# Altium schematic sheet Backup.SchDoc
size A2; SheetNumber: 1; SheetTotal: 1
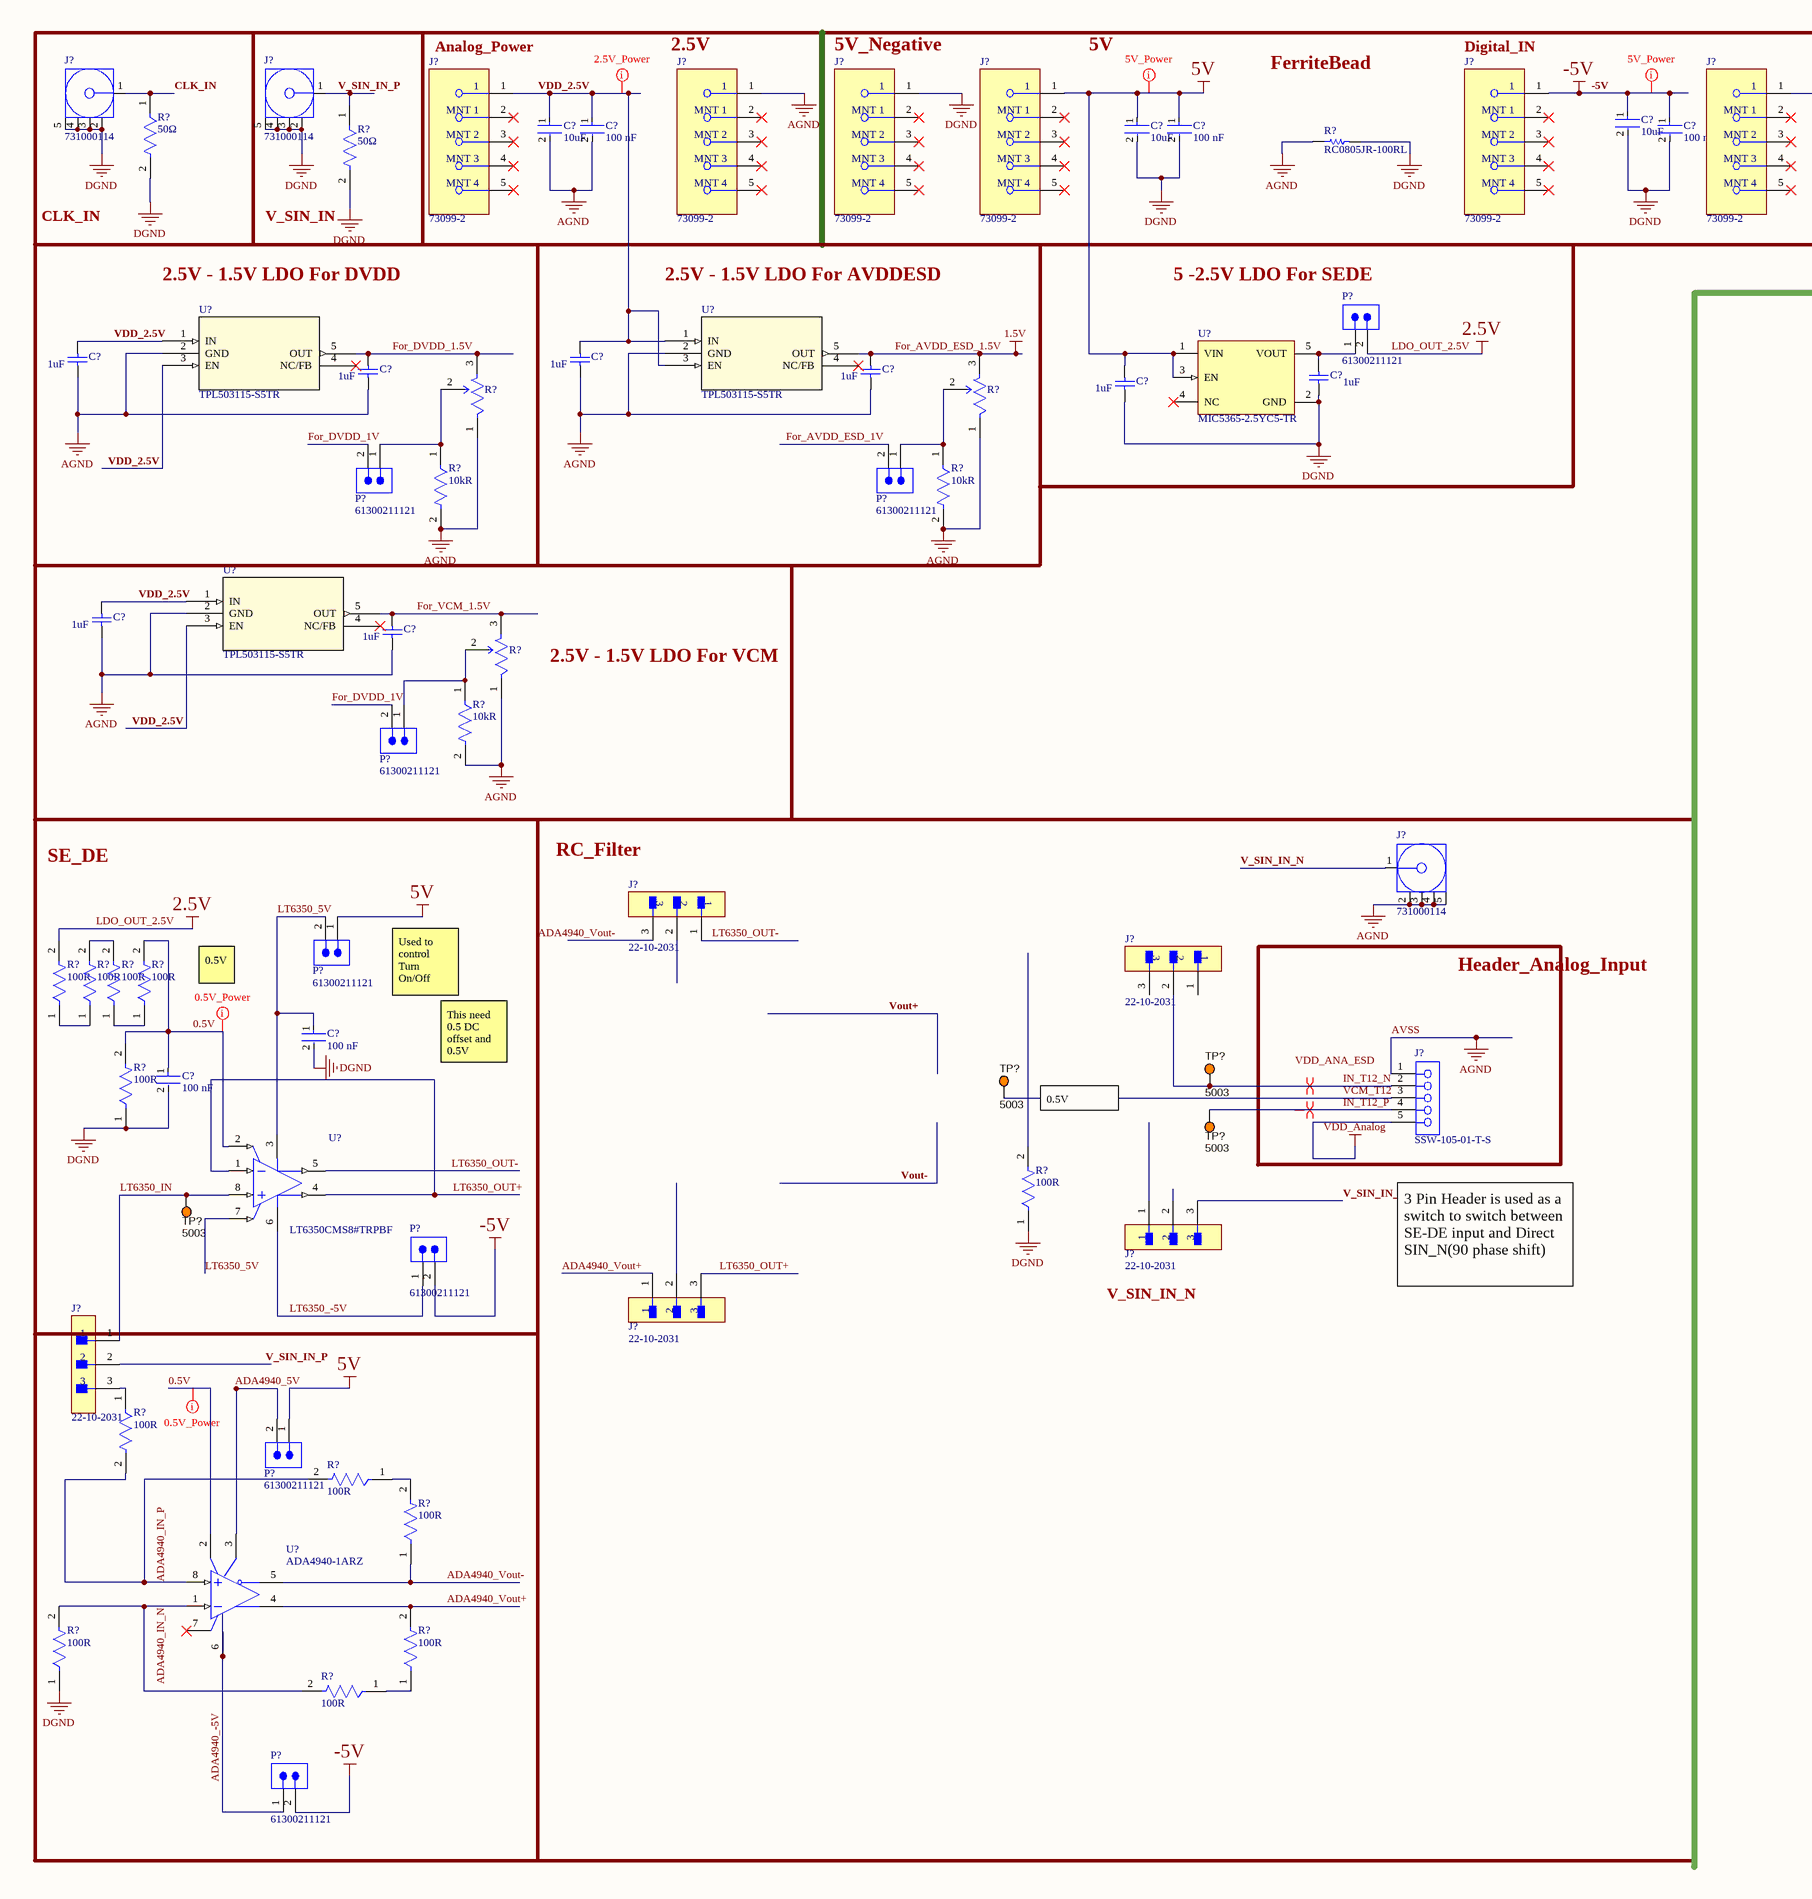
[diagram p0: Backup.SchDoc, left]
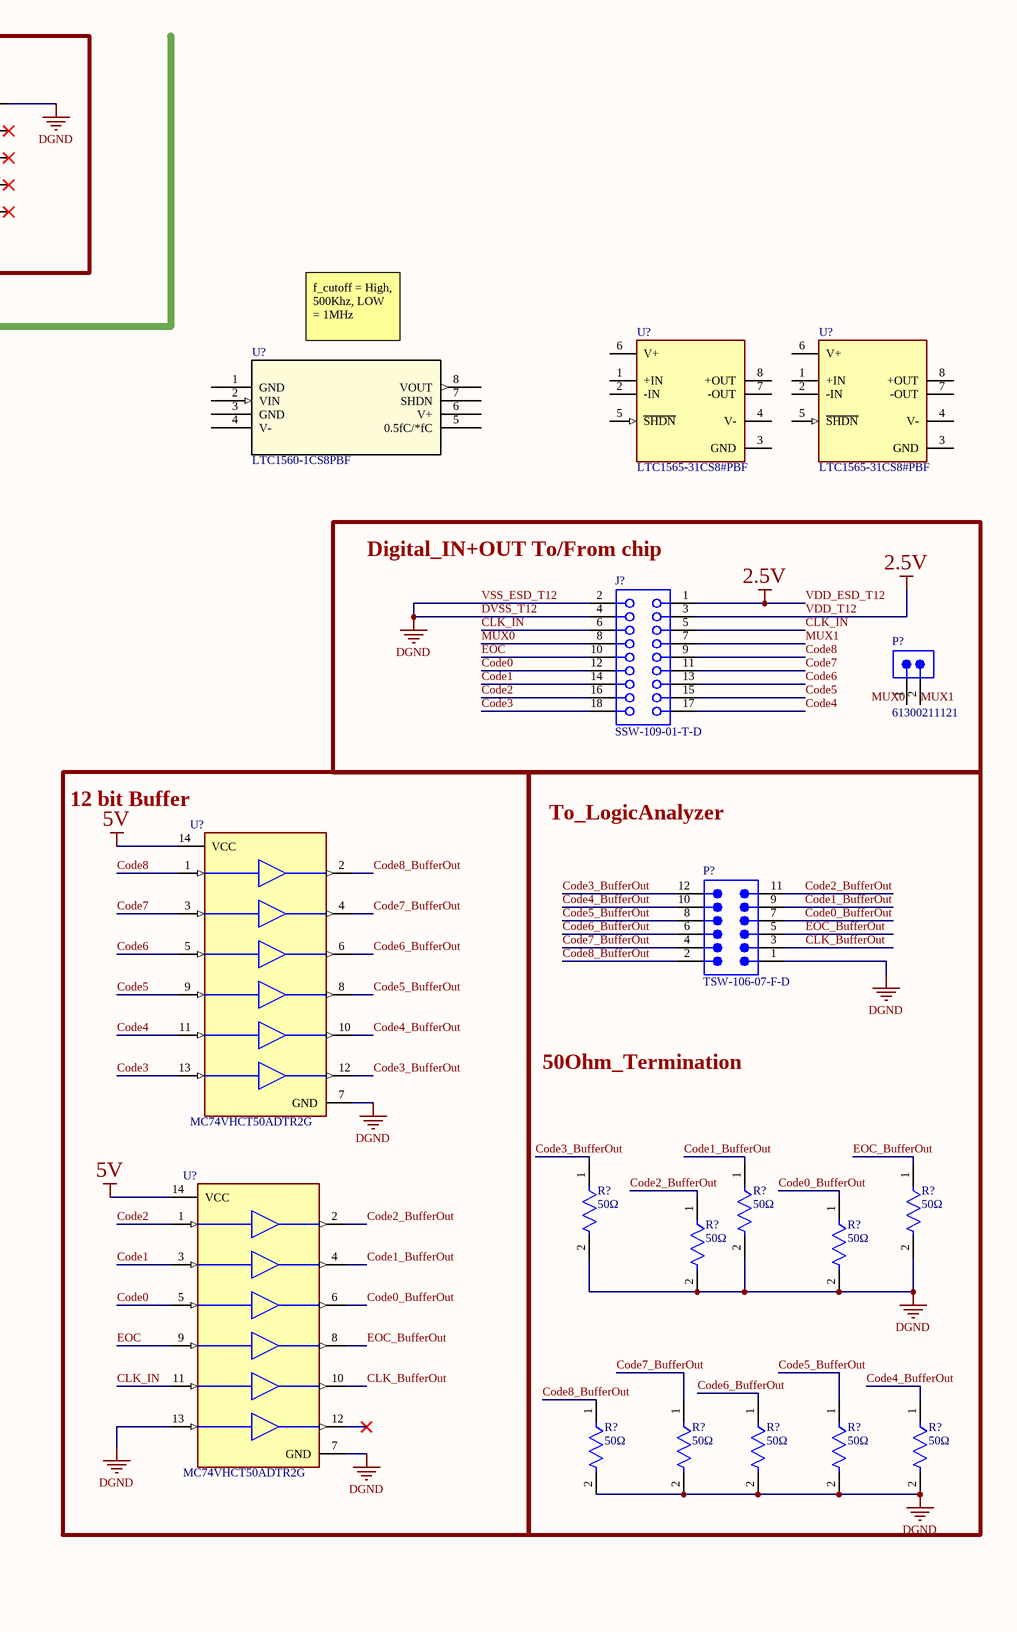
[diagram p1: Backup.SchDoc, right]

## Parts
(Parts that share a designator on the sheet are numbered #1, #2 ... from top to bottom, then left to right.)
C?#1  Capacitance: 10uF  [FP-0805-L_2_01_0_2-W_1_25-MFG]  (hidden comment: 0805ZD106MAT2A)
C?#2  Capacitance: 10uF  [FP-0805-L_2_01_0_2-W_1_25-MFG]  (hidden comment: 0805ZD106MAT2A)
C?#3  Capacitance: 100 nF  [FP-CC0805-0_85-MFG]  (hidden comment: CC0805KRX7R8BB104)
C?#4  Capacitance: 10uF  [FP-0805-L_2_01_0_2-W_1_25-MFG]  (hidden comment: 0805ZD106MAT2A)
C?#5  Capacitance: 100 nF  [FP-CC0805-0_85-MFG]  (hidden comment: CC0805KRX7R8BB104)
C?#6  Capacitance: 100 nF  [FP-CC0805-0_85-MFG]  (hidden comment: CC0805KRX7R8BB104)
C?#7  value 1uF  [CAPC2013X140X50LL20T25]  (hidden comment: 0805ZC105KAZ2A)
C?#8  value 1uF  [CAPC2013X140X50LL20T25]  (hidden comment: 0805ZC105KAZ2A)
C?#9  value 1uF  [CAPC2013X140X50LL20T25]  (hidden comment: 0805ZC105KAZ2A)
C?#10  value 1uF  [CAPC2013X140X50LL20T25]  (hidden comment: 0805ZC105KAZ2A)
C?#11  value 1uF  [CAPC2013X140X50LL20T25]  (hidden comment: 0805ZC105KAZ2A)
C?#12  value 1uF  [CAPC2013X140X50LL20T25]  (hidden comment: 0805ZC105KAZ2A)
C?#13  value 1uF  [CAPC2013X140X50LL20T25]  (hidden comment: 0805ZC105KAZ2A)
C?#14  value 1uF  [CAPC2013X140X50LL20T25]  (hidden comment: 0805ZC105KAZ2A)
C?#15  Capacitance: 100 nF  [FP-CC0805-0_85-MFG]  (hidden comment: CC0805KRX7R8BB104)
C?#16  Capacitance: 100 nF  [FP-CC0805-0_85-MFG]  (hidden comment: CC0805KRX7R8BB104)
J?#1  731000114  [MOLX-731000114_V]
J?#2  731000114  [MOLX-731000114_V]
J?#3  73099-2  [FP-73099-2-MFG]
J?#4  73099-2  [FP-73099-2-MFG]
J?#5  73099-2  [FP-73099-2-MFG]
J?#6  73099-2  [FP-73099-2-MFG]
J?#7  73099-2  [FP-73099-2-MFG]
J?#8  73099-2  [FP-73099-2-MFG]
J?#9  SSW-109-01-T-D  [SMTC-SSW-109-01-X-D]
J?#10  731000114  [MOLX-731000114_V]
J?#11  22-10-2031  [FP-22-10-2031-MFG]
J?#12  22-10-2031  [FP-22-10-2031-MFG]
J?#13  SSW-105-01-T-S  [SMTC-SSW-105-01-X-S]
J?#14  22-10-2031  [FP-22-10-2031-MFG]
J?#15  22-10-2031  [FP-22-10-2031-MFG]
J?#16  22-10-2031  [FP-22-10-2031-MFG]
P?#1  61300211121  [61300211121]
P?#2  61300211121  [61300211121]
P?#3  61300211121  [61300211121]
P?#4  61300211121  [61300211121]
P?#5  61300211121  [61300211121]
P?#6  TSW-106-07-F-D  [SMTC-TSW-106-07-X-D]
P?#7  61300211121  [61300211121]
P?#8  61300211121  [61300211121]
P?#9  61300211121  [61300211121]
P?#10  61300211121  [61300211121]
R?#1  Resistance: 50Ω  [FP-D12-CRCW0805-MFG]  (hidden comment: CRCW080550R0FKTA)
R?#2  Resistance: 50Ω  [FP-D12-CRCW0805-MFG]  (hidden comment: CRCW080550R0FKTA)
R?#3  RC0805JR-100RL  [RESC2013X60X35LL10T20]
R?#4  3296W-1-253LF  [FP-3296W-MFG]  (value not drawn)
R?#5  3296W-1-253LF  [FP-3296W-MFG]  (value not drawn)
R?#6  Resistance: 10kR  [FP-CRCW0805-e3-IPC_A]  (hidden comment: CRCW080510K0FKEA)
R?#7  Resistance: 10kR  [FP-CRCW0805-e3-IPC_A]  (hidden comment: CRCW080510K0FKEA)
R?#8  Resistance: 10kR  [FP-CRCW0805-e3-IPC_A]  (hidden comment: CRCW080510K0FKEA)
R?#9  3296W-1-253LF  [FP-3296W-MFG]  (value not drawn)
R?#10  Resistance: 100R  [FP-CRCW0805-HPe3-IPC_A]  (hidden comment: CRCW0805100RFKEAHP)
R?#11  Resistance: 100R  [FP-CRCW0805-HPe3-IPC_A]  (hidden comment: CRCW0805100RFKEAHP)
R?#12  Resistance: 100R  [FP-CRCW0805-HPe3-IPC_A]  (hidden comment: CRCW0805100RFKEAHP)
R?#13  Resistance: 100R  [FP-CRCW0805-HPe3-IPC_A]  (hidden comment: CRCW0805100RFKEAHP)
R?#14  Resistance: 50Ω  [FP-D12-CRCW0805-MFG]  (hidden comment: CRCW080550R0FKTA)
R?#15  Resistance: 50Ω  [FP-D12-CRCW0805-MFG]  (hidden comment: CRCW080550R0FKTA)
R?#16  Resistance: 50Ω  [FP-D12-CRCW0805-MFG]  (hidden comment: CRCW080550R0FKTA)
R?#17  Resistance: 50Ω  [FP-D12-CRCW0805-MFG]  (hidden comment: CRCW080550R0FKTA)
R?#18  Resistance: 50Ω  [FP-D12-CRCW0805-MFG]  (hidden comment: CRCW080550R0FKTA)
R?#19  Resistance: 100R  [FP-CRCW0805-HPe3-IPC_A]  (hidden comment: CRCW0805100RFKEAHP)
R?#20  Resistance: 100R  [FP-CRCW0805-HPe3-IPC_A]  (hidden comment: CRCW0805100RFKEAHP)
R?#21  Resistance: 50Ω  [FP-D12-CRCW0805-MFG]  (hidden comment: CRCW080550R0FKTA)
R?#22  Resistance: 50Ω  [FP-D12-CRCW0805-MFG]  (hidden comment: CRCW080550R0FKTA)
R?#23  Resistance: 50Ω  [FP-D12-CRCW0805-MFG]  (hidden comment: CRCW080550R0FKTA)
R?#24  Resistance: 50Ω  [FP-D12-CRCW0805-MFG]  (hidden comment: CRCW080550R0FKTA)
R?#25  Resistance: 50Ω  [FP-D12-CRCW0805-MFG]  (hidden comment: CRCW080550R0FKTA)
R?#26  Resistance: 100R  [FP-CRCW0805-HPe3-IPC_A]  (hidden comment: CRCW0805100RFKEAHP)
R?#27  Resistance: 100R  [FP-CRCW0805-HPe3-IPC_A]  (hidden comment: CRCW0805100RFKEAHP)
R?#28  Resistance: 100R  [FP-CRCW0805-HPe3-IPC_A]  (hidden comment: CRCW0805100RFKEAHP)
R?#29  Resistance: 100R  [FP-CRCW0805-HPe3-IPC_A]  (hidden comment: CRCW0805100RFKEAHP)
R?#30  Resistance: 100R  [FP-CRCW0805-HPe3-IPC_A]  (hidden comment: CRCW0805100RFKEAHP)
R?#31  Resistance: 100R  [FP-CRCW0805-HPe3-IPC_A]  (hidden comment: CRCW0805100RFKEAHP)
TP?#1  5003  [KSTN-5003]
TP?#2  5003  [KSTN-5003]
TP?#3  5003  [KSTN-5003]
TP?#4  5003  [KSTN-5003]
U?#1  LTC1565-31CS8#PBF  [FP-S8-8-05-08-1610-MFG]
U?#2  LTC1565-31CS8#PBF  [FP-S8-8-05-08-1610-MFG]
U?#3  TPL503115-S5TR  [SOT23-5-A_TPK]
U?#4  TPL503115-S5TR  [SOT23-5-A_TPK]
U?#5  LTC1560-1CS8PBF  [SO-8_S_LIT]
U?#6  MIC5365-2.5YC5-TR  [FP-SC70-5LD-PL-1-MFG]
U?#7  TPL503115-S5TR  [SOT23-5-A_TPK]
U?#8  MC74VHCT50ADTR2G  [FP-948G-MFG]
U?#9  MC74VHCT50ADTR2G  [FP-948G-MFG]
U?#10  LT6350CMS8#TRPBF  [LT-MS8-8_L]
U?#11  ADA4940-1ARZ  [ADI-R-8_L]

## Blocks framed on the sheet
CLK_IN: J?#1 R?#1
V_SIN_IN: J?#2 R?#2
2.5V - 1.5V LDO For DVDD: C?#7 C?#9 P?#2 R?#4 R?#6 U?#3
2.5V - 1.5V LDO For AVDDESD: C?#8 C?#10 P?#3 R?#5 R?#7 U?#4
5 -2.5V LDO For SEDE: C?#11 C?#12 P?#1 U?#6
Digital_IN+OUT To/From chip: J?#9 P?#4
2.5V - 1.5V LDO For VCM: C?#13 C?#14 P?#5 R?#8 R?#9 U?#7
12 bit Buffer: U?#8 U?#9
SE_DE: C?#15 C?#16 P?#7 P?#8 R?#10-R?#13 R?#19 TP?#4 U?#10
RC_Filter: J?#10-J?#12 J?#14 J?#15 R?#20 TP?#1-TP?#3
Header_Analog_Input: J?#13

## Nets
5V: C?#4.1 C?#5.1 C?#12.2 J?#6.1 P?#7.1 P?#9.1 U?#6.1(VIN) U?#6.3(EN) U?#8.14(VCC) U?#9.14(VCC)
-5V: C?#1.1 C?#6.1 J?#7.1 P?#8.2 P?#10.2
AVSS: C?#2.2 C?#3.2 C?#7.1 C?#8.1 C?#9.1 C?#10.1 C?#13.1 C?#14.1 J?#4.1 J?#10.2 J?#10.3 J?#10.4 J?#10.5 J?#13.1 R?#3.1 R?#4.1(CCW) R?#5.1(CCW) R?#6.2 R?#7.2 R?#8.2 R?#9.1(CCW) U?#3.2(GND) U?#4.2(GND) U?#7.2(GND)  [also labelled AGND]
DVSS_T12: C?#1.2 C?#4.2 C?#5.2 C?#6.2 C?#11.1 C?#12.1 C?#15.2 C?#16.2 J?#1.2 J?#1.3 J?#1.4 J?#1.5 J?#2.2 J?#2.3 J?#2.4 J?#2.5 J?#5.1 J?#8.1 J?#9.2 J?#9.4 P?#6.1 R?#1.2 R?#2.2 R?#3.2 R?#14.2 R?#15.2 R?#16.2 R?#17.2 R?#18.2 R?#19.1 R?#20.1 R?#21.2 R?#22.2 R?#23.2 R?#24.2 R?#25.2 R?#29.1 U?#6.2(GND) U?#8.7(GND) U?#9.7(GND) U?#9.13(A6)  [also labelled DGND, VSS_ESD_T12]
For_AVDD_ESD_1.5V: C?#10.2 R?#5.3(CW) U?#4.5(OUT)  [also labelled 1.5V]
LDO_OUT_2.5V: J?#9.1 J?#9.3 P?#1.2 R?#10.2  [also labelled 2.5V, VDD_ESD_T12, VDD_T12]
VDD_Analog: J?#13.5
0.5V: C?#16.1 R?#13.2 R?#19.2 U?#10.2(+IN2) U?#11.2(VOCM)
ADA4940_5V: P?#9.2 U?#11.3(VS+)
ADA4940_-5V: P?#10.1 U?#11.6(VS-)
ADA4940_IN_N: R?#29.2 R?#30.2 U?#11.1(IN-)
ADA4940_IN_P: R?#26.2 R?#27.2 U?#11.8(IN+)
ADA4940_Vout+: J?#15.1 R?#31.2 U?#11.4(OUT+)
ADA4940_Vout-: J?#11.3 R?#28.1 U?#11.5(OUT-)
CLK_BufferOut: P?#6.3 U?#9.10(Y5)
CLK_IN: J?#1.1 J?#9.5 J?#9.6 R?#1.1 U?#9.11(A5)
Code0: J?#9.12 U?#9.5(A3)
Code0_BufferOut: P?#6.7 R?#18.1 U?#9.6(Y3)
Code1: J?#9.14 U?#9.3(A2)
Code1_BufferOut: P?#6.9 R?#15.1 U?#9.4(Y2)
Code2: J?#9.16 U?#9.1(A1)
Code2_BufferOut: P?#6.11 R?#17.1 U?#9.2(Y1)
Code3: J?#9.18 U?#8.13(A6)
Code3_BufferOut: P?#6.12 R?#14.1 U?#8.12(Y6)
Code4: J?#9.17 U?#8.11(A5)
Code4_BufferOut: P?#6.10 R?#25.1 U?#8.10(Y5)
Code5: J?#9.15 U?#8.9(A4)
Code5_BufferOut: P?#6.8 R?#24.1 U?#8.8(Y4)
Code6: J?#9.13 U?#8.5(A3)
Code6_BufferOut: P?#6.6 R?#23.1 U?#8.6(Y3)
Code7: J?#9.11 U?#8.3(A2)
Code7_BufferOut: P?#6.4 R?#22.1 U?#8.4(Y2)
Code8: J?#9.9 U?#8.1(A1)
Code8_BufferOut: P?#6.2 R?#21.1 U?#8.2(Y1)
EOC: J?#9.10 U?#9.9(A4)
EOC_BufferOut: P?#6.5 R?#16.1 U?#9.8(Y4)
For_AVDD_ESD_1V: P?#3.2
For_DVDD_1.5V: C?#9.2 R?#4.3(CW) U?#3.5(OUT)
For_DVDD_1V: P?#2.2 P?#5.2
For_VCM_1.5V: C?#14.2 R?#9.3(CW) U?#7.5(OUT)
IN_T12_N: J?#12.2 J?#13.2 TP?#1.1
IN_T12_P: J?#13.4 TP?#3.1
LT6350_5V: C?#15.1 P?#7.2 U?#10.3(V+) U?#10.7(~{SHDN})
LT6350_-5V: P?#8.1 U?#10.6(V-)
LT6350_IN: J?#16.1 TP?#4.1 U?#10.8(+IN1)
LT6350_OUT+: J?#15.3 U?#10.1(-IN1) U?#10.4(OUT1)
LT6350_OUT-: J?#11.1 U?#10.5(OUT2)
MUX0: J?#9.8 P?#4.1
MUX1: J?#9.7 P?#4.2
V_SIN_IN_N: J?#10.1
V_SIN_IN_P: J?#2.1 J?#14.3 J?#16.2 R?#2.1
VCM_T12: J?#13.3 TP?#2.1
VDD_2.5V: C?#2.1 C?#3.1 C?#7.2 C?#8.2 C?#13.2 J?#3.1 U?#3.1(IN) U?#3.3(EN) U?#4.1(IN) U?#4.3(EN) U?#7.1(IN) U?#7.3(EN)
NetC?#11_2: C?#11.2 P?#1.1 U?#6.5(VOUT)
NetJ?#16_3: J?#16.3 R?#26.1
NetP?#2_1: P?#2.1 R?#4.2(WIPER) R?#6.1
NetP?#3_1: P?#3.1 R?#5.2(WIPER) R?#7.1
NetP?#5_1: P?#5.1 R?#8.1 R?#9.2(WIPER)
NetR?#10_1: R?#10.1 R?#11.1
NetR?#11_2: R?#11.2 R?#12.2
NetR?#12_1: R?#12.1 R?#13.1
NetR?#27_1: R?#27.1 R?#28.2
NetR?#30_1: R?#30.1 R?#31.1

Not connected (* = marked no-connect by the designer): J?#3 2(MNT_1)* 3(MNT_2)* 4(MNT_3)* 5(MNT_4)*; J?#4 2(MNT_1)* 3(MNT_2)* 4(MNT_3)* 5(MNT_4)*; J?#5 2(MNT_1)* 3(MNT_2)* 4(MNT_3)* 5(MNT_4)*; J?#6 2(MNT_1)* 3(MNT_2)* 4(MNT_3)* 5(MNT_4)*; J?#7 2(MNT_1)* 3(MNT_2)* 4(MNT_3)* 5(MNT_4)*; J?#8 2(MNT_1)* 3(MNT_2)* 4(MNT_3)* 5(MNT_4)*; J?#11 2; J?#12 1 3; J?#14 1 2; J?#15 2; R?#20 2; U?#1 1(+IN) 2(-IN) 3(GND) 4(V-) 5(~{SHDN}) 6(V+) 7(-OUT) 8(+OUT); U?#2 1(+IN) 2(-IN) 3(GND) 4(V-) 5(~{SHDN}) 6(V+) 7(-OUT) 8(+OUT); U?#3 4(NC/FB)*; U?#4 4(NC/FB)*; U?#5 1(GND) 2(VIN) 3(GND) 4(V-) 5(0.5fC/*fC) 6(V+) 7(SHDN) 8(VOUT); U?#6 4(NC)*; U?#7 4(NC/FB)*; U?#9 12(Y6)*; U?#11 7(~{DISABLE})*

## Layout directives
differential pair: IN_T12_N, IN_T12_P
rule Width Constraint [Pref Width = 40mil    Min Width = 20mil    Max Width = 100mil]: -5V
rule Width Constraint [Pref Width = 20mil    Min Width = 20mil    Max Width = 100mil]: 0.5V, 5V, VDD_2.5V

## Notes on the sheet
- (near J?#3) Analog_Power
- (near J?#4) 2.5V
- (near J?#5) 5V_Negative
- 5V
- FerriteBead
- (near J?#7) Digital_IN
- (near U?#5) f_cutoff = High,  500Khz, LOW = 1MHz
- To_LogicAnalyzer
- 0.5V
- Used to control Turn On/Off
- 50Ohm_Termination
- This need 0.5 DC offset and 0.5V Amplitude
- (near TP?#2) 0.5V
- V_SIN_IN_N
- 3 Pin Header is used as a switch to switch between SE-DE input and Direct SIN_N(90 phase shift)
- Labels drawn without touching a wire or pin: VDD_ANA_ESD

## Library data of the parts
C?#1 C?#2 C?#4 = CMP-2007-04682-2: General Purpose Ceramic Capacitor, 0805, 10uF, 20%, X5R, 15%, 10V; Dissipation Factor: 12.5%; Insulation Resistance: 10GR; Contact Plating: Tin; Packaging: Tape and Reel; Length: 2.01mm; Dielectric: X5R; RoHS Compliant: Yes; Series: -; Case Code (Metric): 2012; Tolerance: 20%; Min Operating Temperature: -55°C; REACH SVHC: No SVHC; Termination: SMD/SMT; Width: 0.049inch; Mount: Surface Mount; Construction: Flat; Lead Free: Lead Free; Depth: 1.25mm; Height: 1.3mm; Voltage: 10V; Case Code (Imperial): 0805; Package Quantity: 3000; Number of Pins: 2; Voltage Rating (DC): 10V; Radiation Hardening: No; Case/Package: 0805; Max Operating Temperature: 85°C; Voltage Rating: 10V; Thickness: 0.055inch; Dielectric Material: Ceramic
C?#3 C?#5 C?#6 C?#15 C?#16 = CMP-1036-04410-2: CAP CER 0.1UF 25V X7R 0805; Manufacturer: Yageo; Tolerance: 0.1; Material: Ceramic; Value: 100 nF; ComponentLink2URL: http://www.yageo.com/documents/recent/UPY-GPHC_Y5V_6.3V-to-50V_8.pdf; Category: Cap; Mouser Description: Multilayer Ceramic Capacitors MLCC - SMD/SMT 100nF 25V X7R 10%; Manufacturer Part Number: CC0805KRX7R8BB104; Device Class L1: Passive Components; Footprint Url: http://www.yageo.com/exep/pages/download/literatures/UPY-C_GEN_24.pdf; Height: 0.95mm; Digikey Description: CAP CER 0.1UF 25V X7R 0805; Lead Free: Yes; Temperature Range High: +85°C; Temperature: -30°C to +85°C; Ipc Land Pattern Name: CAPC200125X85; Automotive: No; Octopart: https://octopart.com/cc0805krx7r8bb104-yageo-39467766; Device Class L2: Capacitors; Temperature Characteristic: X7R; Voltage Rating: 25 V; ComponentLink2Description: Datasheet; Temperature Range Low: -30°C; Device Class L3: Ceramic Capacitors; RoHS: TRUE; Package: CC0805-0.85
C?#7-C?#14 = CMP-2007-04674-1: Manufacturer: AVX Interconnect / Elco; Part Number: 0805ZC105KAZ2A
J?#1 J?#2 J?#10 = CMP-2000-05487-1: SMA Right-Angle PCB Jack Receptacle, Brass Body, Gold Plated, 50 Ohm, 5-Pin THD, RoHS, Tray; Manufacturer: Molex; Datasheet Version: 09/2016; Package Description: 5-Pin Through Hole Device, Body 14.8 x 6.35 mm, Pitch 2.54 mm; Datasheet URL: http://www.molex.com/webdocs/datasheets/pdf/en-us/0731000114_RF_COAX_CONNECTORS.pdf; Manufacturer URL: http://www.molex.com/; Package Reference: 731000114; Mounting Technology: ThroughHole; Package URL: http://www.molex.com/pdm_docs/sd/731000114_sd.pdf
J?#3-J?#8 = CMP-73906-000005-1: R/A 4MM MOUNTG SAFE JACK/PCB RED
J?#9 = CMP-1023-00387-1: SQ Post Socket, Through-hole, Vertical, -55 to 105 degC, 2.54mm Pitch, 18-Pin, Female, RoHS; Manufacturer: Samtec; Mounting Technology: Through-hole; Orientation: Vertical; Pitch: 2.54 mm; DatasheetVersion: F-214; ComponentLink3Description: Package Specification; ComponentLink1Description: Manufacturer URL; PartNumber: SSW-109-01-T-D; RoHS: True; PackageVersion: CA, 6/1987; ComponentLink2URL: http://www.samtec.com/documents/webfiles/pdf/SSW_TH.PDF; ComponentLink2Description: Datasheet; ComponentLink3URL: http://www.samtec.com/documents/webfiles/cpdf/SSW-1XX-XX-XXX-X-XX-XXX-XX-MKT.pdf; PackageDescription: Assembly, Socket Strip .016 X .031 Tail; Temperature Range: -55 to 105 degC; PackageReference: SSW-109-01-X-D; ComponentLink1URL: http://www.samtec.com
J?#11 J?#12 J?#14-J?#16 = CMP-04776-000653-1: CONN HEADER VERT 3POS 2.54MM; Insulation Resistance: 50GR; Glow Wire Compliant: Non-compliant; Number of Contacts: 3; Max Current Rating: 4A; Voltage Rating (DC): 250V; Gender: Male; Contact Resistance: 10mR; Approvals: UL; Color: White; Radiation Hardening: No; Pitch: 2.54mm; Packaging: Bulk; Orientation: Straight; Housing Material: Nylon; Depth: 2.34mm; Flammability Rating: UL94 V-0; Number of Circuits: 3; Min Operating Temperature: 0°C; Lead Free: Lead Free; Contact Plating: Gold; Halogen Free: Low Halogen; Max Voltage Rating (AC): 250V; Length: 7.37mm; Height: 10.79mm; Current Rating: 4A; Series: KK® 4030; Contact Material: Brass; Number of Rows: 1; Housing Color: White; Voltage Rating: 250V; Package Quantity: 2000; Number of Positions: 3; Contact Type: Male Pin; Mount: Through Hole; Max Operating Temperature: 75°C; Termination: Solder; Contact Mating Length: 0.295inch
J?#13 = CMP-1023-00345-1: SQ Post Socket, Through-hole, Vertical, -55 to 105 degC, 2.54mm Pitch, 5-Pin, Female, RoHS; Manufacturer: Samtec; Pitch: 2.54 mm; Orientation: Vertical; ComponentLink1Description: Manufacturer URL; ComponentLink1URL: http://www.samtec.com; RoHS: True; PackageDescription: Assembly, Socket Strip .016 X .031 Tail; PackageReference: SSW-105-01-X-S; ComponentLink3URL: http://www.samtec.com/documents/webfiles/cpdf/SSW-1XX-XX-XXX-X-XX-XXX-XX-MKT.pdf; PartNumber: SSW-105-01-T-S; Temperature Range: -55 to 105 degC; Mounting Technology: Through-hole; PackageVersion: CA, 6/1987; ComponentLink2URL: http://www.samtec.com/documents/webfiles/pdf/SSW_TH.PDF; DatasheetVersion: F-214; ComponentLink2Description: Datasheet; ComponentLink3Description: Package Specification
P?#1-P?#5 P?#7-P?#10 = CMP-1712-00002-6: NexarPartId: 20081794; Number of Contacts: 2; Pitch: 2.54mm; Connector Type: Male Pin; Voltage Rating: 250V; Current Rating: 3A; Gender: Male; Contact Resistance: 20mΩ; Height: 8.94mm; Lead Free: Lead Free; Number of Pins: 2; Termination: Through Hole; RoHS: Compliant; Lead Pitch: 2.54mm; REACH SVHC: No SVHC; Housing Material: PBT; Contact Mating Length: 5.9944mm; Min Operating Temperature: -40°C; Orientation: Vertical; Contact Material: Copper; Contact Gender: Male; Max Operating Temperature: 125°C; Number of Rows: 1; Number of Positions: 2; Packaging: Bulk; Contact Plating: Gold; Mount: Through Hole; Color: Black; Operating Supply Voltage: 250V
P?#6 = CMP-1024-00381-1: 0.025" SQ Post Header, Through-hole, Vertical, -55 to 125 degC, 2.54 mm Pitch, 12-Pin, Male, RoHS; Manufacturer: Samtec; Pitch: 2.54 mm; ComponentLink2Description: Datasheet; Mounting Technology: Through-hole; Orientation: Vertical; DatasheetVersion: F-214; ComponentLink3Description: Package Specification; Temperature Range: -55 to 125 degC; ComponentLink1URL: http://www.samtec.com; PackageVersion: DM, 8/1988; ComponentLink1Description: Manufacturer URL; PackageReference: TSW-106-07-X-D; ComponentLink3URL: http://www.samtec.com/documents/webfiles/cpdf/TSW-XXX-XX-XXX-X-XX-XXX-MKT.pdf; ComponentLink2URL: http://www.samtec.com/documents/webfiles/pdf/TSW_TH.PDF; PackageDescription: .025[0.64] SQ. Post Terminal Strip Assembly; PartNumber: TSW-106-07-F-D; RoHS: True
R?#1 R?#2 R?#14-R?#18 R?#21-R?#25 = CMP-00030-21390498-1: CRCW080550R0FKTA Res Thick Film 0805 50 Ohm 1% 0.125W(1/8W) ±100ppm/C Pad SMD Automotive T/R; Temperature Coefficient: 100ppm/°C; Voltage Rating: 150V; Power Rating: 125mW; Length: 2mm; Case Code (Imperial): 0805; Height: 450µm; Contact Plating: Lead, Tin; Width: 1.25mm; Max Operating Temperature: 155°C; NexarPartId: 21390498; Case Code (Metric): 2012; Min Operating Temperature: -55°C; Tolerance: 1%; Case/Package: 0805; Lead Free: Contains Lead; RoHS: Non-Compliant; Composition: Thick Film; Weight: 5.499807mg
R?#3 = CMP-2000-06963-1: Chip Resistor, 0 Ohm, +/- 5%, 125 mW, -55 to 155 degC, 0805 (2012 Metric), RoHS, Tape and Reel; Manufacturer: Yageo; Product Length (mm): 2mm; Tolerance (+ or -): NotRequired; Case Style: Molded; Product Height (mm): 0.5mm; Power Rating(s): NotRequiredW; Product Depth (mm): 1.25mm; Mounting Technology: SurfaceMount; Military Standard: NotRequired; Operating Temp Range: -55Cto155C; Temperature Coefficient: NotRequired; Package Description: 2-Pin Surface Mounted Device, Body 2 x 1.25 mm; Datasheet Version: Rev. 7, 05/2017; Failure Rate: NotRequired; Manufacturer URL: http://www.yageo.com/; Datasheet URL: http://www.yageo.com/documents/recent/PYu-RC_Group_51_RoHS_L_7.pdf; Packaging: TapeandReel; Package Reference: 0805; Package / Case: 0805; Termination Style: NotRequired; Type: ThickFilm; Construction: Rectangular
R?#4 R?#5 R?#9 = CMP-07234-000034-1: TRIMMER 25K OHM 0.5W PC PIN TOP; Temperature Coefficient: 100ppm/°C; Resistance Tolerance: 10%; Resistance: 25kR; Power Rating: 500mW; Number of Turns: 25; Voltage Rating (DC): 300V; Taper: Linear; Resistor Type: Cermet; REACH SVHC: No SVHC; Height: 0.395inch; Military Standard: Not; Color: Blue; Tolerance: 10%; Depth: 4.83mm; Package Quantity: 50; Termination: Pin; Radiation Hardening: No; Packaging: Rail/Tube; Lead Free: Lead Free; Length: 9.53mm; Series: 3296; Weight: 0.03oz; RoHS Compliant: Yes; Mount: Panel; Max Power Dissipation: 500mW; Width: 9.53mm; Technology: CERMET; Min Operating Temperature: -55°C; Max Operating Temperature: 125°C
R?#6-R?#8 = CMP-2001-04908-2: RES Thick Film, 10kΩ, 1%, 0.125W, 100ppm/°C, 0805; Voltage Rating (DC): 150V; Power Rating: 125mW; Weight: 0.000194oz; Package Quantity: 5000; Military Standard: Not; Max Operating Temperature: 155°C; Temperature Coefficient: 100ppm/°C; Contact Plating: Tin; Width: 1.25mm; Height: 0.45mm; Radiation Hardening: No; Tolerance: 1%; Min Operating Temperature: -55°C; Voltage Rating: 150V; Length: 2mm; Depth: 1.25mm; Termination: SMD/SMT; Packaging: Tape and Reel; Case/Package: 0805; Case Code (Metric): 2012; Lead Free: Lead Free; Case Code (Imperial): 0805; Composition: Thick Film
R?#10-R?#13 R?#19 R?#20 R?#26-R?#31 = CMP-02407-011702-1: RES Thick Film, 100Ω, 1%, 0.5W, 100ppm/°C, 0805; Power Rating: 330mW; Voltage Rating: 150V; Max Power Dissipation: 500mW; Case/Package: 0805; Radiation Hardening: No; Number of Terminations: 2; Features: Automotive AEC-Q200; RoHS Compliant: Yes; Height: 0.5mm; Technology: THICK FILM; Contact Plating: Tin; Series: CRCW-HP; Max Operating Temperature: 155°C; Tolerance: 1%; Package Quantity: 5000; Construction: Rectangular; Width: 1.2mm; Lead Free: Lead Free; Resistor Type: Thick Film; Resistance Tolerance: 1%; Length: 2mm; Weight: 0.000194oz; Termination: SMD/SMT; Depth: 1.25mm; Packaging: Tape and Reel; Voltage Rating (DC): 150V; Case Code (Imperial): 0805; Military Standard: Not; Case Code (Metric): 2012; Mount: Surface Mount; Min Operating Temperature: -55°C; Temperature Coefficient: 100ppm/°C
TP?#1-TP?#4 = CMP-1672-00009-1: Test Point, Orange, 1-Pin THD, RoHS; Peak Reverse Current: 600 uA; Forward Current: 3 A; Max Surge Current: 80 A; Forward Voltage: 1.08 V; Max Operating Temperature: 150 degC; PackageReference: 5003; Pins: 2; ComponentLink2URL: http://keyelco.com/userAssets/file/M65p56.pdf; PackageDescription: 1-Pin Through Hole Device, Dia 2.54 mm; Weight: 0.01 lb; Diameter: 5.3 mm; Mount: Through Hole; Package Quantity: 500; Packaging: Bulk; Min Operating Temperature: -65 degC; ComponentLink1Description: Manufacturer URL; Height: 0.25 inch; ComponentLink1URL: http://www.keyelco.com/; ComponentLink2Description: Datasheet; Width: 0.25 inch; REACH SVHC: No SVHC; RoHSCompliant: true; Radiation Hardening: No; Length: 9.5 mm; DatasheetVersion: Jun-15
U?#1 U?#2 = CMP-00026-88317526-1: LTC1565-31CS8#PBF Active Filter Single Continuous Time Low Pass 7th Order 650kHz 8-Pin SOIC N Tube; Manufacturer Lifecycle Status: PRODUCTION; Nominal Supply Current: 25mA; Number of Channels: 1; Dual Supply Voltage: 5V; Max Supply Voltage: 11V; Min Supply Voltage: 4.75V; Min Dual Supply Voltage: 2.375V; Max Dual Supply Voltage: 5.5V; Radiation Hardening: No; Case/Package: SOIC N; Max Operating Temperature: 70°C; Lead Free: Lead Free; Lifecycle Status: Production; Min Operating Temperature: 0°C; Type: Active; NexarPartId: 88317526; Number of Pins: 8; Mount: Surface Mount; Operating Supply Voltage: 5V; RoHS: Compliant; Number of Circuits: 1
U?#3 U?#4 U?#7 = TPL503115-S5TR: No Description Available; Mfr_Name: 3Peak; RefDes: RefDes; Type: Type
U?#5 = LTC1560-1CS8PBF: No Description Available; Mfr_Name: Analog Devices Inc; RefDes: RefDes; Type: Type
U?#6 = CMP-06324-000051-1: IC REG LINEAR 2.5V 150MA SC70-5; Output Voltage Accuracy: 2%; Max Input Voltage: 5.5V; Quiescent Current: 39uA; Output Type: Fixed; Number of Outputs: 1; Min Current Limit: 200mA; Polarity: Positive; Dropout Voltage: 180mV; Power Supply Rejection Ratio (PSRR): 80dB; REACH SVHC: No SVHC; Min Output Voltage: 2.5V; Lead Free: Lead Free; RoHS Compliant: Yes; Mount: Surface Mount; Min Operating Temperature: -40°C; Output Current: 150mA; Nominal Output Voltage: 2.5V; Case/Package: SC; Packaging: Tape and Reel; Number of Regulators: 1; Series: -; Radiation Hardening: No; Number of Pins: 5; Package Quantity: 1; Output Voltage: 2.5V; Max Operating Temperature: 125°C; Max Output Current: 150mA; Min Input Voltage: 2.5V
U?#8 U?#9 = CMP-07106-000009-1: IC BUF NON-INVERT 5.5V 14TSSOP; Number of Channels: 6; High Level Output Current: -8mA; Logic Function: Buffer; Number of Output Lines: 3; Polarity: Non-Inverting; Low Level Output Current: 8mA; Min Supply Voltage: 2V; Number of Bits per Element: 1; Max Power Dissipation: 450mW; Turn-On Delay Time: 10.5ns; Quiescent Current: 2uA; Mount: Surface Mount; Max Supply Voltage: 5.5V; Min Operating Temperature: -55°C; REACH SVHC: No SVHC; Number of Input Lines: 6; Radiation Hardening: No; Case/Package: TSSOP; Max Operating Temperature: 125°C; Number of Inputs: 6; Lead Free: Lead Free; Contact Plating: Gold; Number of Bits: 6; Number of Pins: 14; Propagation Delay: 10.5ns; Number of Elements: 6; Package Quantity: 1; Halogen Free: Halogen Free; Packaging: Tape and Reel; Number of Outputs: 6
U?#10 = CMP-0359-00906-2: Single Channel, Low Noise Single-Ended to Differential Converter / ADC Driver, 33 MHz Typical GBW, 48 V/us Typical SR, 2.7 to 12 V, 8-Pin SOP (MS8-8), Commercial, Pb-Free, Reel; Manufacturer: Linear Technology; Linear Technology Part Number: LT6350; Vs Min (V): 2.7; Channels (#): 1; Is (mA) Typical: 4.5; Vs Max (V): 12; Vos (mV) Guaranteed: 0.45; Vos (mV) Typical: 0.1; GBW (MHz) Typical: 33; SR (V/us) Typical: 48; ComponentLink2URL: http://cds.linear.com/docs/en/datasheet/6350f.pdf; Mounting Technology: Surface Mount; DatasheetVersion: Rev. B; PackageDescription: 8-Lead Plastic Small Outline, Body 3.9 x 4.9 mm, Pitch 1.27 mm; Packing: Reel; PartNumber: LT6350CMS8#TRPBF; ComponentLink3URL: http://cds.linear.com/docs/en/packaging/05081610_G_SO8.pdf; RevisionNote: URLs updated; ComponentLink1URL: http://www.linear.com/; Type: DIFF; ComponentLink1Description: Manufacturer URL; PackageReference: LT-MS8-8; ComponentLink3Description: Package Specification; RoHS: Pb-Free; PackageVersion: Rev G; ComponentLink2Description: Datasheet
U?#11 = CMP-1331-00005-2: Ultralow Power, Low Distortion Fully Differential ADC Driver, 3 to 6 V, -40 to 125 degC, 8-Pin SOIC_N (R-8), RoHS, Tube